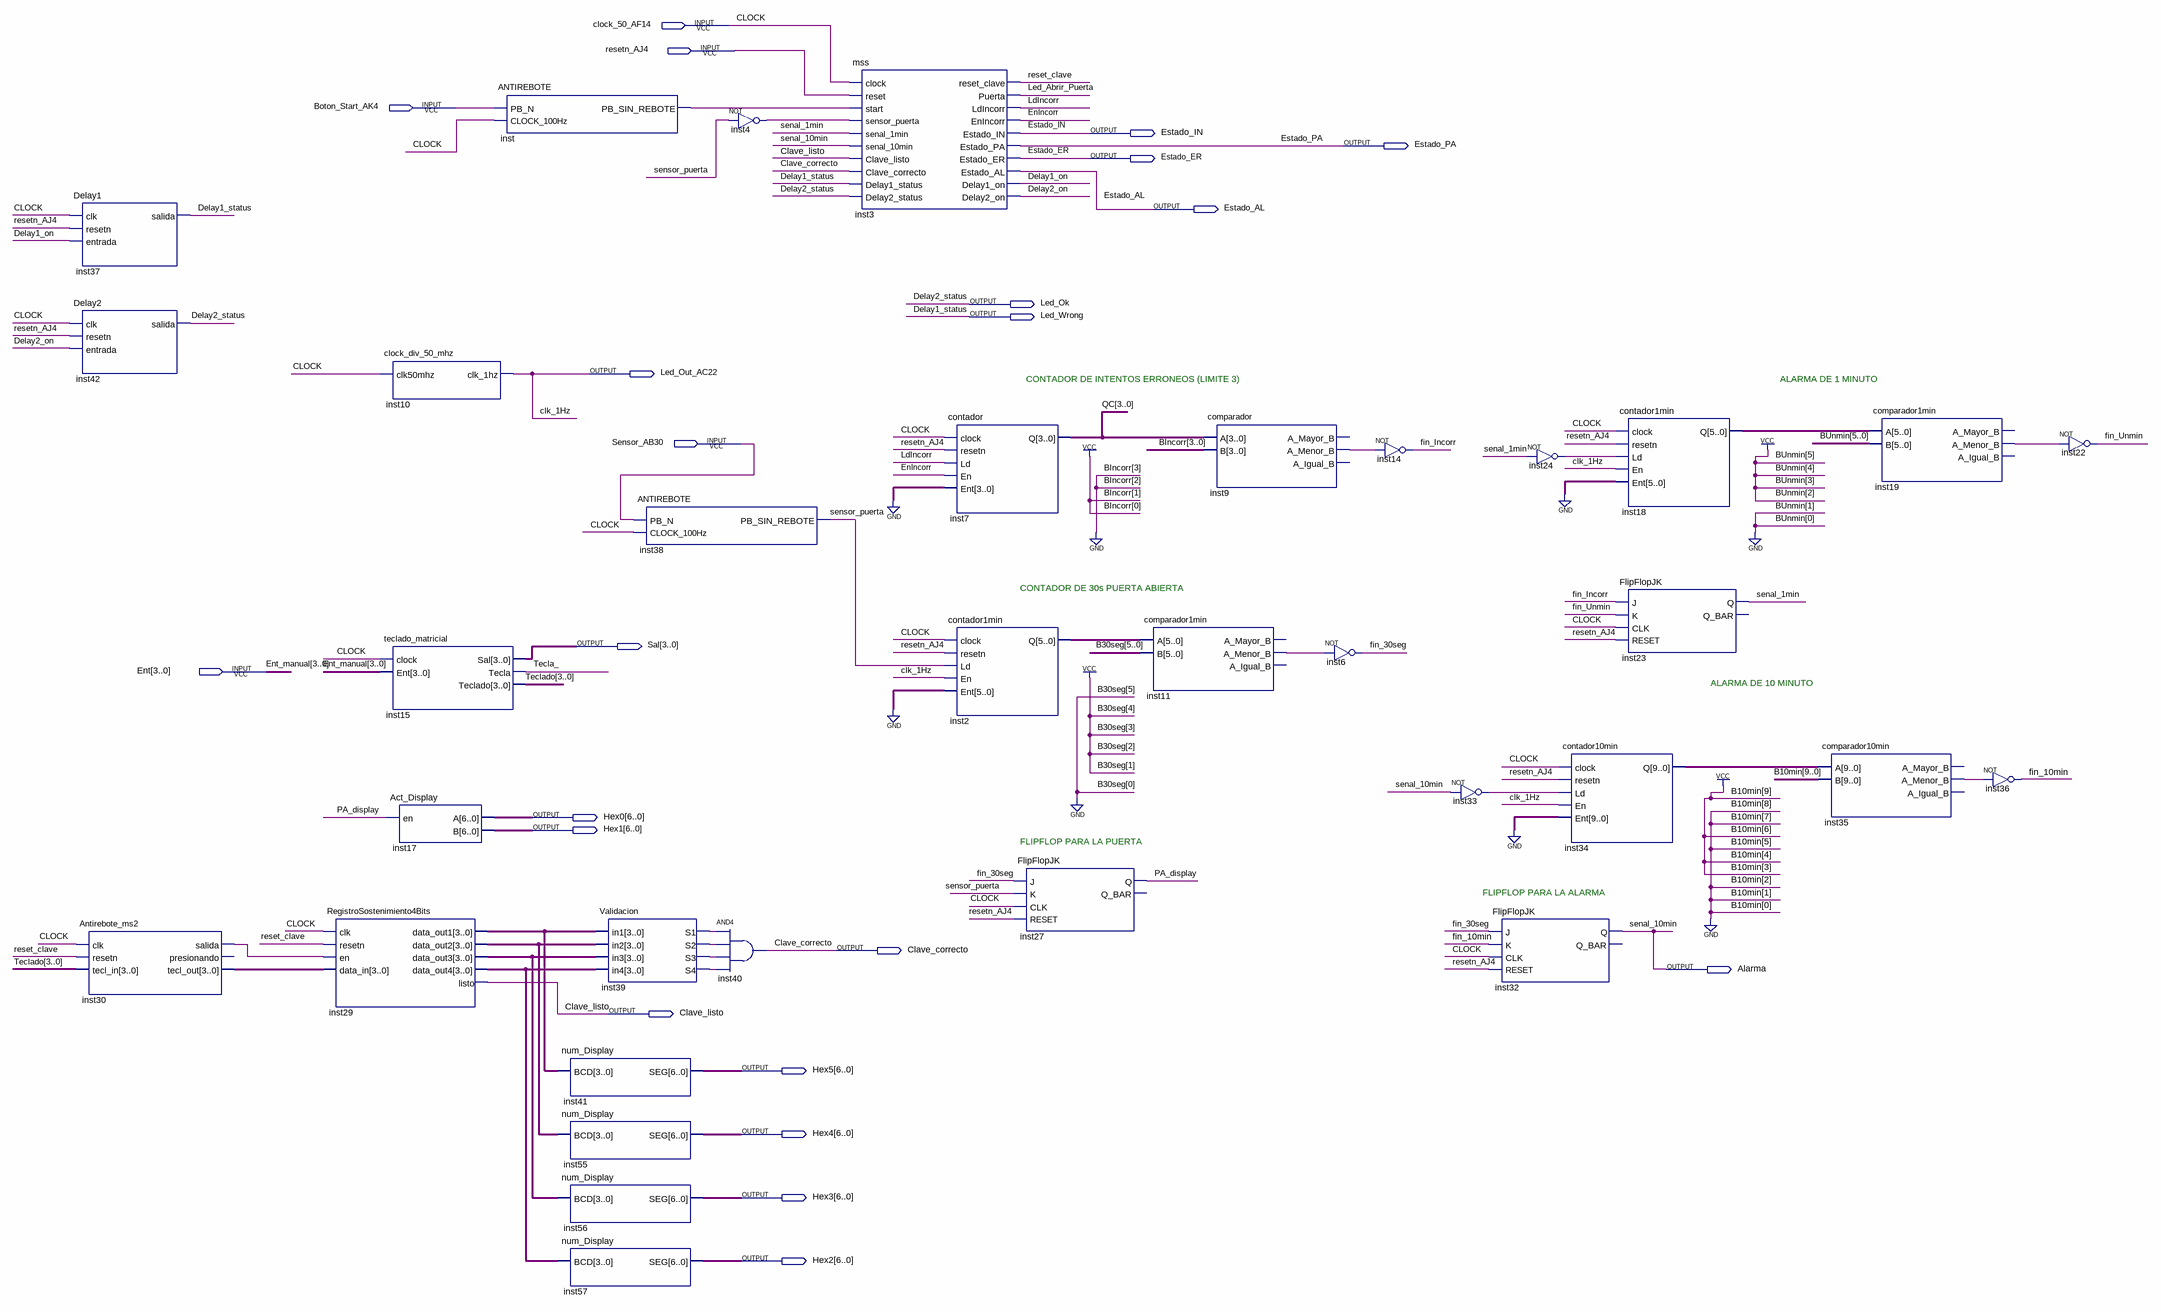
[diagram p0: schematic sheet]
// Quartus schematic Proyecto_Test1.bdf as structural Verilog: 34 symbols, 22 pins
module Proyecto_Test1 (
  input  clock_50_AF14,
  input  resetn_AJ4,
  input  Boton_Start_AK4,
  input  Sensor_AB30,
  input  [3:0] Ent,
  output Estado_IN,
  output Estado_PA,
  output Estado_ER,
  output Estado_AL,
  output Led_Ok,
  output Led_Wrong,
  output Led_Out_AC22,
  output [3:0] Sal,
  output [6:0] Hex0,
  output [6:0] Hex1,
  output Clave_correcto,
  output Alarma,
  output Clave_listo,
  output [6:0] Hex5,
  output [6:0] Hex4,
  output [6:0] Hex3,
  output [6:0] Hex2
);

  wire Delay1_on, Delay2_on, EnIncorr, fin_10min, fin_30seg, fin_Incorr, fin_Unmin, inst4_out,
       inst9_a_menor_b, inst11_a_menor_b, inst19_a_menor_b, inst24_out, inst30_salida, inst33_out,
       inst35_a_menor_b, inst39_s1, inst39_s2, inst39_s3, inst39_s4, inst_pb_sin_rebote, LdIncorr,
       Led_Abrir_Puerta, PA_display, reset_clave, senal_1min, sensor_puerta, Tecla_;
  wire [3:0] inst29_data_out1, inst29_data_out2, inst29_data_out3, inst29_data_out4, inst30_tecl_out, QC,
       Teclado;
  wire [5:0] inst2_q, inst18_q;
  wire [9:0] inst34_q;

  Delay1 inst37 (.clk(clock_50_AF14), .resetn(resetn_AJ4), .entrada(Delay1_on), .salida(Led_Wrong));
  Delay2 inst42 (.clk(clock_50_AF14), .resetn(resetn_AJ4), .entrada(Delay2_on), .salida(Led_Ok));
  Antirebote_ms2 inst30 (
    .clk(clock_50_AF14), .resetn(reset_clave), .tecl_in(Teclado), .salida(inst30_salida),
    .tecl_out(inst30_tecl_out));  // open: presionando
  RegistroSostenimiento4Bits inst29 (
    .clk(clock_50_AF14), .resetn(reset_clave), .en(inst30_salida), .data_in(inst30_tecl_out),
    .data_out1(inst29_data_out1), .data_out2(inst29_data_out2), .data_out3(inst29_data_out3),
    .data_out4(inst29_data_out4), .listo(Clave_listo));
  clock_div_50_mhz inst10 (.clk50mhz(clock_50_AF14), .clk_1hz(Led_Out_AC22));
  teclado_matricial inst15 (.clock(clock_50_AF14), .Ent(Ent), .Sal(Sal), .Tecla(Tecla_), .Teclado(Teclado));
  Act_Display inst17 (.en(PA_display), .A(Hex0), .B(Hex1));
  ANTIREBOTE inst (.PB_N(Boton_Start_AK4), .CLOCK_100Hz(clock_50_AF14), .PB_SIN_REBOTE(inst_pb_sin_rebote));
  num_Display inst41 (.BCD(inst29_data_out1), .SEG(Hex5));
  num_Display inst55 (.BCD(inst29_data_out2), .SEG(Hex4));
  num_Display inst56 (.BCD(inst29_data_out3), .SEG(Hex3));
  num_Display inst57 (.BCD(inst29_data_out4), .SEG(Hex2));
  Validacion inst39 (
    .in1(inst29_data_out1), .in2(inst29_data_out2), .in3(inst29_data_out3), .in4(inst29_data_out4),
    .S1(inst39_s1), .S2(inst39_s2), .S3(inst39_s3), .S4(inst39_s4));
  ANTIREBOTE inst38 (.PB_N(Sensor_AB30), .CLOCK_100Hz(clock_50_AF14), .PB_SIN_REBOTE(sensor_puerta));
  and inst40 (Clave_correcto, inst39_s1, inst39_s2, inst39_s3, inst39_s4);
  not inst4 (inst4_out, sensor_puerta);
  mss inst3 (
    .clock(clock_50_AF14), .reset(resetn_AJ4), .start(inst_pb_sin_rebote), .sensor_puerta(inst4_out),
    .senal_1min(senal_1min), .senal_10min(Alarma), .Clave_listo(Clave_listo),
    .Clave_correcto(Clave_correcto), .Delay1_status(Led_Wrong), .Delay2_status(Led_Ok),
    .reset_clave(reset_clave), .Puerta(Led_Abrir_Puerta), .LdIncorr(LdIncorr), .EnIncorr(EnIncorr),
    .Estado_IN(Estado_IN), .Estado_PA(Estado_PA), .Estado_ER(Estado_ER), .Estado_AL(Estado_AL),
    .Delay1_on(Delay1_on), .Delay2_on(Delay2_on));
  contador inst7 (.clock(clock_50_AF14), .resetn(resetn_AJ4), .Ld(LdIncorr), .En(EnIncorr), .Ent(4'b0000), .Q(QC));
  contador1min inst2 (
    .clock(clock_50_AF14), .resetn(resetn_AJ4), .Ld(sensor_puerta), .En(Led_Out_AC22), .Ent({6{1'b0}}),
    .Q(inst2_q));
  FlipFlopJK inst27 (
    .J(fin_30seg), .K(sensor_puerta), .CLK(clock_50_AF14), .RESET(resetn_AJ4), .Q(PA_display));  // open: Q_BAR
  comparador1min inst11 (.A(inst2_q), .B(6'b011110), .A_Menor_B(inst11_a_menor_b));  // open: A_Mayor_B, A_Igual_B
  comparador inst9 (.A(QC), .B(4'b0011), .A_Menor_B(inst9_a_menor_b));  // open: A_Mayor_B, A_Igual_B
  not inst6 (fin_30seg, inst11_a_menor_b);
  not inst14 (fin_Incorr, inst9_a_menor_b);
  not inst33 (inst33_out, Alarma);
  not inst24 (inst24_out, senal_1min);
  FlipFlopJK inst32 (.J(fin_30seg), .K(fin_10min), .CLK(clock_50_AF14), .RESET(resetn_AJ4), .Q(Alarma));  // open: Q_BAR
  contador10min inst34 (
    .clock(clock_50_AF14), .resetn(resetn_AJ4), .Ld(inst33_out), .En(Led_Out_AC22), .Ent({10{1'b0}}),
    .Q(inst34_q));
  contador1min inst18 (
    .clock(clock_50_AF14), .resetn(resetn_AJ4), .Ld(inst24_out), .En(Led_Out_AC22), .Ent({6{1'b0}}),
    .Q(inst18_q));
  FlipFlopJK inst23 (
    .J(fin_Incorr), .K(fin_Unmin), .CLK(clock_50_AF14), .RESET(resetn_AJ4), .Q(senal_1min));  // open: Q_BAR
  comparador10min inst35 (
    .A(inst34_q), .B(10'b1001011000), .A_Menor_B(inst35_a_menor_b));  // open: A_Mayor_B, A_Igual_B
  comparador1min inst19 (.A(inst18_q), .B(6'b111100), .A_Menor_B(inst19_a_menor_b));  // open: A_Mayor_B, A_Igual_B
  not inst36 (fin_10min, inst35_a_menor_b);
  not inst22 (fin_Unmin, inst19_a_menor_b);

  // Other names for the same wires on the sheet: senal_10min = Alarma; clk_1Hz = Led_Out_AC22; CLOCK = clock_50_AF14;
  //   Delay1_status = Led_Wrong; Delay2_status = Led_Ok; Ent_manual[3:0] = Ent

  // Notes on the sheet:
  //   CONTADOR DE INTENTOS ERRONEOS (LIMITE 3)
  //   ALARMA DE 1 MINUTO
  //   CONTADOR DE 30s PUERTA ABIERTA
  //   ALARMA DE 10 MINUTO
  //   FLIPFLOP PARA LA PUERTA
  //   FLIPFLOP PARA LA ALARMA
endmodule
